# EAGLE design arduino-dice (EAGLE 6.5.0)
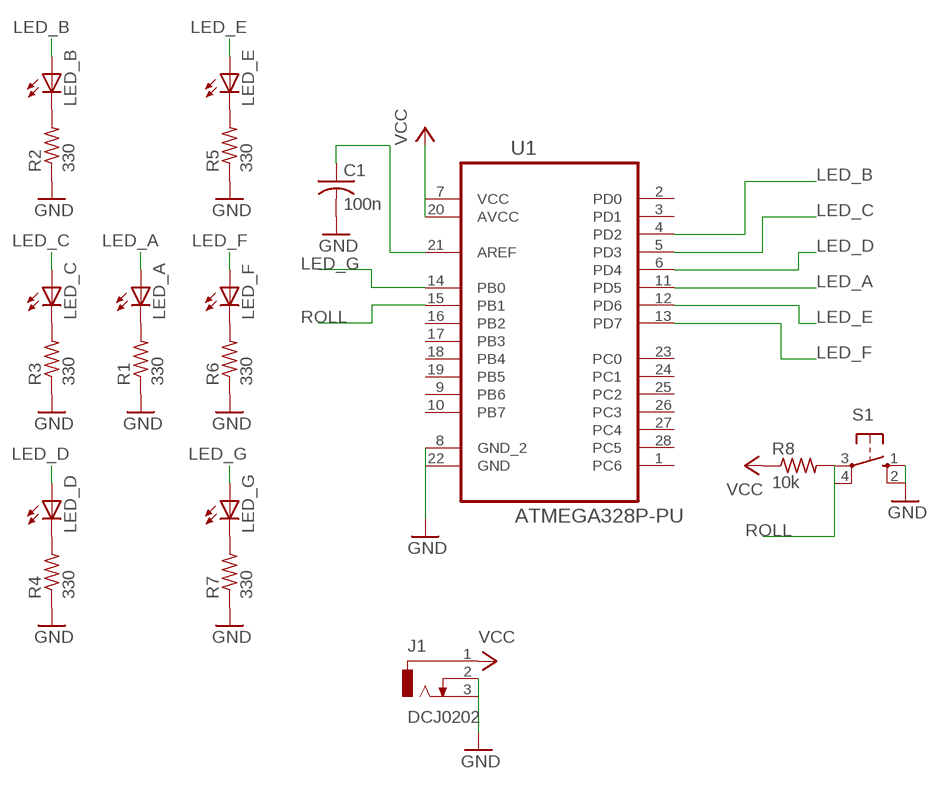
[diagram p0: schematic, sheet 1]

## Parts
C1  100n  C-US050-024X044  [C050-024X044]
J1  DCJ0202  [DCJ0202]
LED_A  LED5MM  [LED5MM]
LED_B  LED5MM  [LED5MM]
LED_C  LED5MM  [LED5MM]
LED_D  LED5MM  [LED5MM]
LED_E  LED5MM  [LED5MM]
LED_F  LED5MM  [LED5MM]
LED_G  LED5MM  [LED5MM]
R1  330  R-US_0207/10  [0207/10]
R2  330  R-US_0207/10  [0207/10]
R3  330  R-US_0207/10  [0207/10]
R4  330  R-US_0207/10  [0207/10]
R5  330  R-US_0207/10  [0207/10]
R6  330  R-US_0207/10  [0207/10]
R7  330  R-US_0207/10  [0207/10]
R8  10k  R-US_0207/10  [0207/10]
S1  10-XX  [B3F-10XX]
U1  ATMEGA328P-PU  [DIP254P762X457-28]

## Nets
GND: C1.2 J1.2 J1.3 R1.1 R2.1 R3.1 R4.1 R5.1 R6.1 R7.1 S1.1(S) S1.2(S1) U1.8(GND_2) U1.22(GND)
LED_A: LED_A.A U1.11(PD5)
LED_B: LED_B.A U1.4(PD2)
LED_C: LED_C.A U1.5(PD3)
LED_D: LED_D.A U1.6(PD4)
LED_E: LED_E.A U1.12(PD6)
LED_F: LED_F.A U1.13(PD7)
LED_G: LED_G.A U1.14(PB0)
N$1: LED_A.K(C) R1.2
N$2: LED_B.K(C) R2.2
N$3: LED_C.K(C) R3.2
N$4: LED_D.K(C) R4.2
N$5: LED_E.K(C) R5.2
N$6: LED_G.K(C) R7.2
N$7: LED_F.K(C) R6.2
N$17: C1.1 U1.21(AREF)
ROLL: R8.2 S1.3(P) S1.4(P1) U1.15(PB1)
VCC: J1.1 R8.1 U1.7(VCC) U1.20(AVCC)
Unconnected: U1.1(PC6) U1.2(PD0) U1.3(PD1) U1.9(PB6) U1.10(PB7) U1.16(PB2) U1.17(PB3) U1.18(PB4) U1.19(PB5) U1.23(PC0) U1.24(PC1) U1.25(PC2) U1.26(PC3) U1.27(PC4) U1.28(PC5)

## Library data of the parts
C1 = rcl:C-US: CAPACITOR, American symbol
J1 = con-jack:DCJ0202: DC POWER JACK Source: DCJ0202.pdf; OC_FARNELL: unknown; OC_NEWARK: unknown
LED_A LED_B LED_C LED_D LED_E LED_F LED_G = led:LED: LED OSRAM: - CHIPLED LG R971, LG N971, LY N971, LG Q971, LY Q971, LO R971, LY R971 LH N974, LH R974 LS Q976, LO Q976, LY Q976 LO Q996 - Hyper CHIPLED LW Q18S LB Q993, LB Q99A, LB R99A - SideLED LS A670, LO A670, LY A670, LG A670, LP A670 LB A673, LV A673, LT A673, LW A673 LH A674 LY A675 LS A676, LA A676, LO A676, LY A676, LW A676 LS A679, LY A679, LG A679 - Hyper Micro SIDELED® LS Y876, LA Y876, LO Y876, LY Y876 LT Y87S - SmartLED LW L88C, LW L88S LB L89C, LB L89S, LG L890 LS L89K, LO L89K, LY L89K LS L896, LA L896, LO L896, LY L896 - TOPLED LS T670, LO T670, LY T670, LG T670, LP T670 LSG T670, LSP T670, LSY T670, LOP T670, LYG T670 LG T671, LOG T671, LSG T671 LB T673, LV T673, LT T673, LW T673 LH T674 LS T676, LA T676, LO T676, LY T676, LB T676, LH T676, LSB T676, LW T676 LB T67C, LV T67C, LT T67C, LS T67K, LO T67K, LY T67K, LW E67C LS E67B, LA E67B, LO E67B, LY E67B, LB E67C, LV E67C, LT E67C LW T67C LS T679, LY T679, LG T679 LS T770, LO T770, LY T770, LG T770, LP T770 LB T773, LV T773, LT T773, LW T773 LH T774 LS E675, LA E675, LY E675, LS T675 LS T776, LA T776, LO T776, LY T776, LB T776 LHGB T686 LT T68C, LB T68C - Hyper Mini TOPLED® LB M676 - Mini TOPLED Santana® LG M470 LS M47K, LO M47K, LY M47K Source: http://www.osram.convergy.de LUXEON: - LUMILED® LXK2-PW12-R00, LXK2-PW12-S00, LXK2-PW14-U00, LXK2-PW14-V00 LXK2-PM12-R00, LXK2-PM12-S00, LXK2-PM14-U00 LXK2-PE12-Q00, LXK2-PE12-R00, LXK2-PE12-S00, LXK2-PE14-T00, LXK2-PE14-U00 LXK2-PB12-K00, LXK2-PB12-L00, LXK2-PB12-M00, LXK2-PB14-N00, LXK2-PB14-P00, LXK2-PB14-Q00 LXK2-PR12-L00, LXK2-PR12-M00, LXK2-PR14-Q00, LXK2-PR14-R00 LXK2-PD12-Q00, LXK2-PD12-R00, LXK2-PD12-S00 LXK2-PH12-R00, LXK2-PH12-S00 LXK2-PL12-P00, LXK2-PL12-Q00, LXK2-PL12-R00 Source: www.luxeon.com KINGBRIGHT: KA-3528ASYC Source: www.kingbright.com
R1-R8 = resistor:R-US_: RESISTOR, American symbol
S1 = switch-omron:10-XX: OMRON SWITCH; MPN: B3F-1000; OC_FARNELL: 176432; OC_NEWARK: 36M3542
U1 = Atmel_By_element14_Batch_1-00:ATMEGA328P-PU: 8-bit Microcontroller with In-System Programmable Flash; MPN: ATMEGA328P-PU; OC_FARNELL: 1715487; OC_NEWARK: 15R0268; PACKAGE: PDIP-28; SUPPLIER: Atmel

## Net classes
0 default: clearance 0.205 mm

## Board
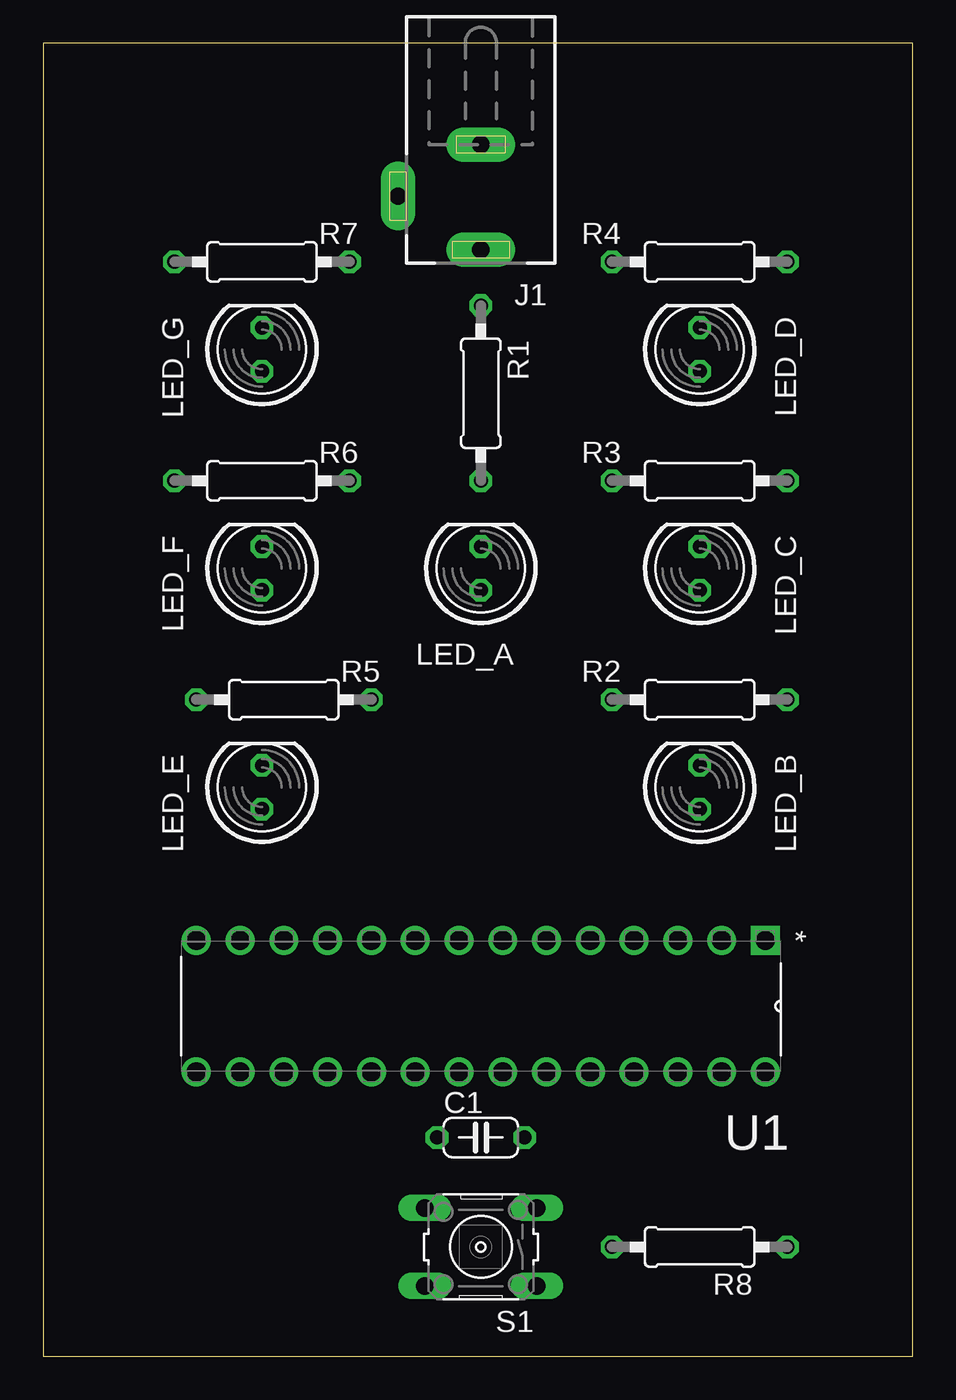
[diagram p1: board, top side]
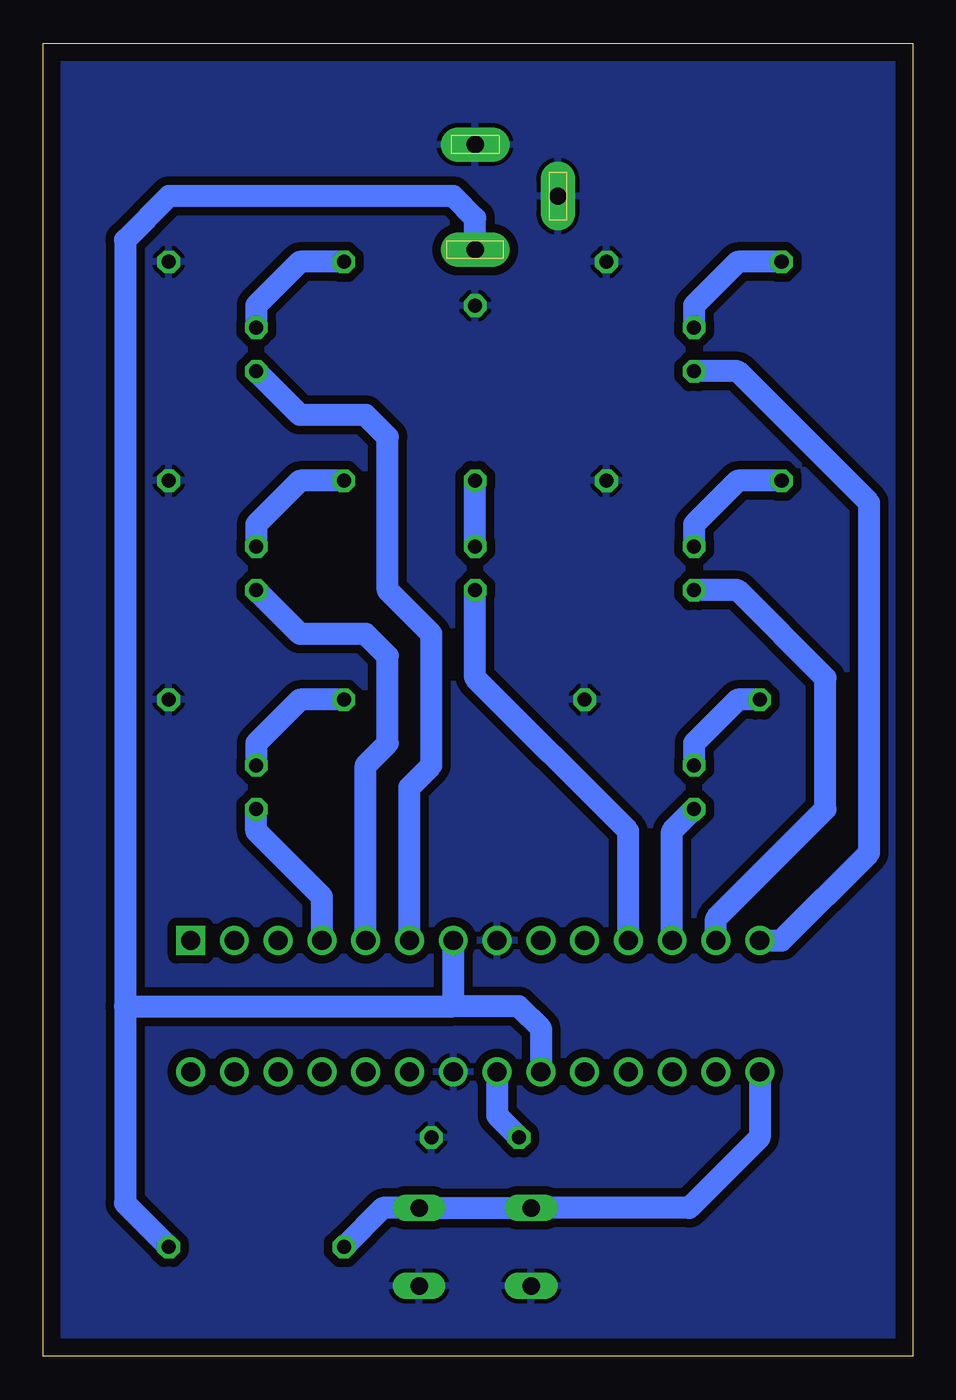
[diagram p2: board, bottom side, seen from below]

Size 50.47 x 76.19 mm. Coordinates in mm from the lower left corner, seen from the top.
Outline: 0,0 50.47,0 50.47,76.19 0,76.19 0,0
Copper layers (1*16): Top 0.035mm / dielectric 1.5mm / Bottom 0.035mm
Design rules "dice *": minimum track width 10mil, minimum drill 24mil, track to track 0.5mm, track to pad 0.4mm, pad to pad 0.4mm, via to via 0.3mm, smd to smd 0.3mm, copper to edge 40mil, drill to drill 8mil, minimum pad ring 10mil, minimum via ring 8mil, stop-mask expansion 4mil, vias tented up to drill 0mil, thermal gap 10mil

### Footprints (pad centres in the part's own frame; a part is rotated, then mirrored left to right if it is on the bottom)
C050-024X044 = drill 0.813 octagon: 1 -2.54,0; 2 2.54,0
DCJ0202 = drill 1 pad 2 long: 1 0,3.1; 2 4.8,0; 3 0,-3
LED5MM = drill 0.813 octagon: A -1.27,0; K 1.27,0
0207/10 = drill 0.813 octagon: 1 -5.08,0; 2 5.08,0
B3F-10XX = drill 1.016 long: 1 -3.251,2.261; 2 3.251,2.261; 3 -3.251,-2.261; 4 3.251,-2.261
DIP254P762X457-28 = drill 1.118 square: 1 -7.62,33.02 | drill 1.118: 2 -7.62,30.48; 3 -7.62,27.94; 4 -7.62,25.4; 5 -7.62,22.86; 6 -7.62,20.32; 7 -7.62,17.78; 8 -7.62,15.24; 9 -7.62,12.7; 10 -7.62,10.16; 11 -7.62,7.62; 12 -7.62,5.08; 13 -7.62,2.54; 14 -7.62,0; 15 0,0; 16 0,2.54; 17 0,5.08; 18 0,7.62; 19 0,10.16; 20 0,12.7; 21 0,15.24; 22 0,17.78; 23 0,20.32; 24 0,22.86; 25 0,25.4; 26 0,27.94; 27 0,30.48; 28 0,33.02

### Placement (x,y rotation side)
C1  25.4,12.7 0 top
J1  25.4,67.31 180 top
LED_A  25.4,45.72 90 top
LED_B  38.1,33.02 90 top
LED_C  38.1,45.72 90 top
LED_D  38.1,58.42 90 top
LED_E  12.7,33.02 90 top
LED_F  12.7,45.72 90 top
LED_G  12.7,58.42 90 top
R1  25.4,55.88 270 top
R2  38.1,38.1 180 top
R3  38.1,50.8 180 top
R4  38.1,63.5 180 top
R5  13.97,38.1 180 top
R6  12.7,50.8 180 top
R7  12.7,63.5 180 top
R8  38.1,6.35 180 top
S1  25.4,6.35 180 top
U1  8.89,16.51 270 top

### Tracks (layer width: path | path; a pad name or v marks a point on that pad's centre or on a via)
GND
  pour Bottom: -2.54,80.01 53.34,80.01 53.34,-3.81 -2.54,-3.81
LED_A
  Bottom 1.27: U1.11 16.51,30.48 25.4,39.37 LED_A.A
LED_B
  Bottom 1.27: U1.4 34.29,26.67 38.1,30.48 LED_B.A
LED_C
  Bottom 1.27: U1.5 31.75,34.29 30.48,35.56 30.48,40.64 31.75,41.91 35.56,41.91 LED_C.A
LED_D
  Bottom 1.27: U1.6 29.21,33.02 27.94,34.29 27.94,41.91 30.48,44.45 30.48,53.34 31.75,54.61 35.56,54.61 LED_D.A
LED_E
  Bottom 1.27: U1.12 13.97,30.48 LED_E.A
LED_F
  Bottom 1.27: U1.13 11.43,25.4 5.08,31.75 5.08,39.37 10.16,44.45 LED_F.A
LED_G
  Bottom 1.27: LED_G.A 10.16,57.15 2.54,49.53 2.54,29.21 7.62,24.13 U1.14
N$1
  Bottom 1.27: LED_A.K R1.2
N$2
  Bottom 1.27: R2.2 35.56,38.1 38.1,35.56 LED_B.K
N$3
  Bottom 1.27: R3.2 35.56,50.8 38.1,48.26 LED_C.K
N$4
  Bottom 1.27: R4.2 35.56,63.5 38.1,60.96 LED_D.K
N$5
  Bottom 1.27: R5.2 10.16,38.1 12.7,35.56 LED_E.K
N$6
  Bottom 1.27: R7.2 10.16,63.5 12.7,60.96 LED_G.K
N$7
  Bottom 1.27: R6.2 10.16,50.8 12.7,48.26 LED_F.K
N$17
  Bottom 1.27: U1.21 24.13,13.97 C1.1
ROLL
  Bottom 1.27: R8.2 30.76,8.61 S1.3 S1.4 12.98,8.61 8.89,12.7 U1.15
VCC
  Bottom 1.27: 26.67,20.32 22.86,20.32 21.59,19.05 U1.20 | 26.67,20.32 U1.7 | R8.1 45.72,8.89 45.72,20.32 | 45.72,20.32 26.67,20.32 | 45.72,20.32 45.72,64.77 43.18,67.31 26.67,67.31 25.4,66.04 J1.1